# Altium schematic sheet max5134.SchDoc
size A4
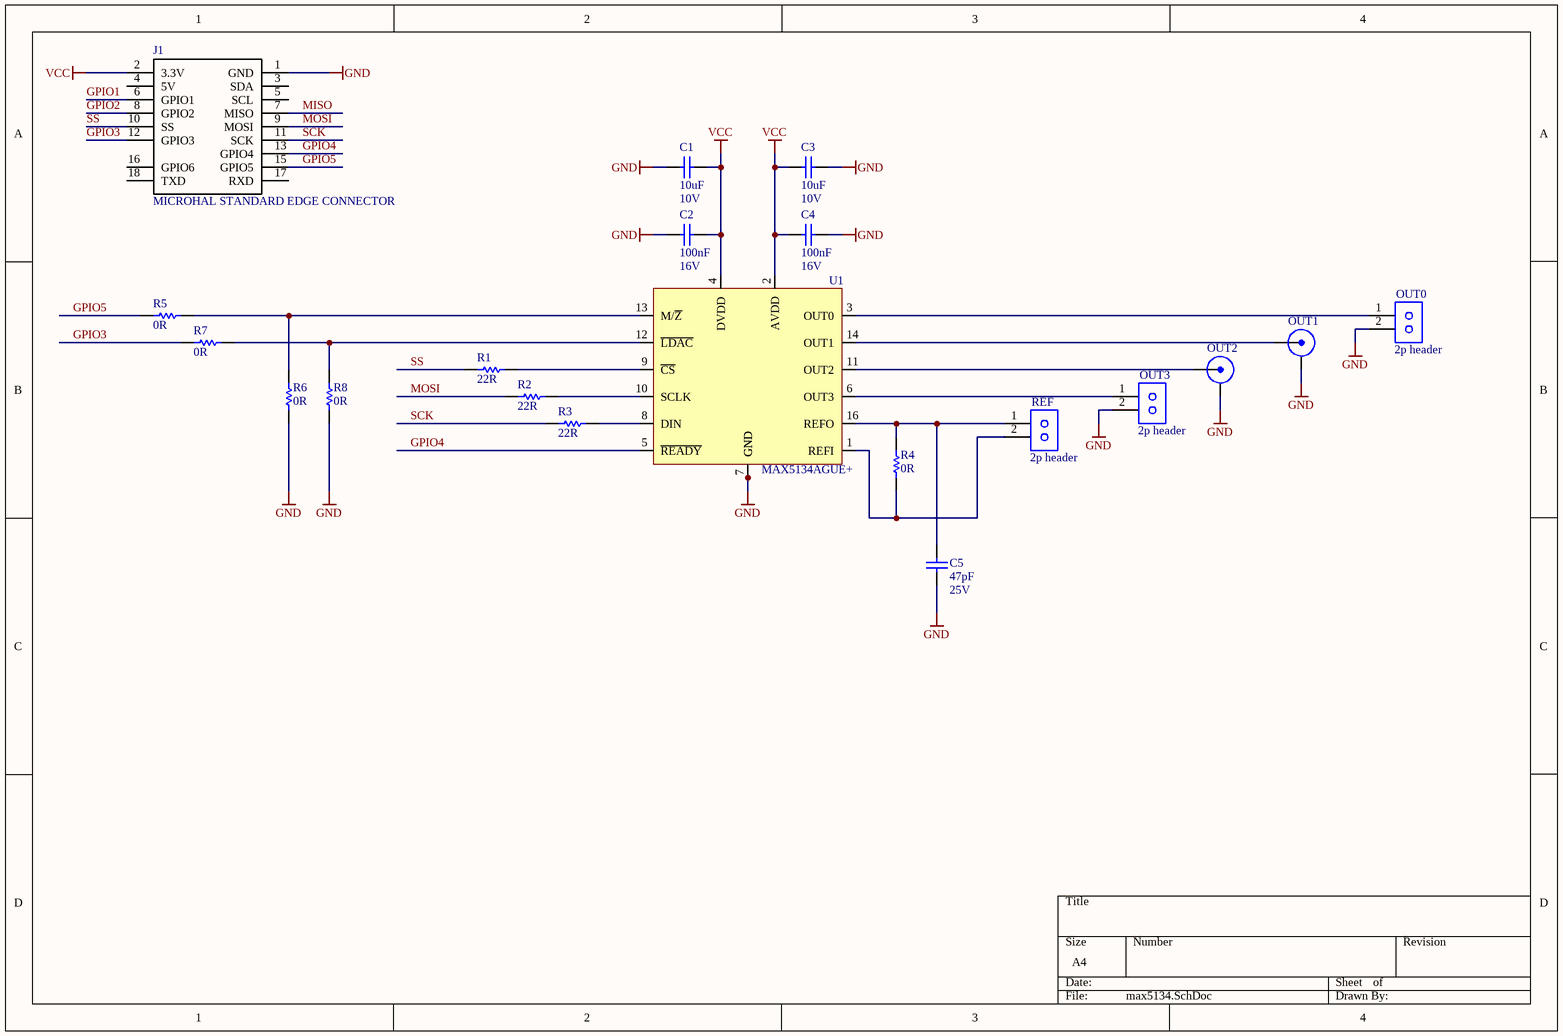
[diagram p0: max5134.SchDoc]

## Parts
C1  value 10uF  Voltage: 10V  [PCB-pgfgxap6j3hfn0qwxn05-1]  (hidden comment: Cap)
C2  value 100nF  Voltage: 16V  [PCB-ul7goghxin8pri3xfob7-1]  (hidden comment: Cap)
C3  value 10uF  Voltage: 10V  [PCB-pgfgxap6j3hfn0qwxn05-1]  (hidden comment: Cap)
C4  value 100nF  Voltage: 16V  [PCB-ul7goghxin8pri3xfob7-1]  (hidden comment: Cap)
C5  Capacitance: 47pF  Voltage Rating (DC): 25V  [CAPC1608X87X35NL15T15]  (hidden comment: Kemet C0603C470J3GACTU)
J1  MICROHAL STANDARD EDGE CONNECTOR  [PCB-n61ghpg3sznbl2uw6fwj-1]
OUT0  2p header  [PCB-b2cwpysm67pz35t2479s-1]
OUT1  Amphenol Connex 132136RP  [PCB-qsvob2veabkktiupk4ti-1]  (value not drawn)
OUT2  Amphenol Connex 132136RP  [PCB-qsvob2veabkktiupk4ti-1]  (value not drawn)
OUT3  2p header  [PCB-b2cwpysm67pz35t2479s-1]
R1  Resistance: 22R  [RESC1609X50X30ML10T20]  (hidden comment: Vishay Dale CRCW060322R0JNEA)
R2  Resistance: 22R  [RESC1609X50X30ML10T20]  (hidden comment: Vishay Dale CRCW060322R0JNEA)
R3  Resistance: 22R  [RESC1609X50X30ML10T20]  (hidden comment: Vishay Dale CRCW060322R0JNEA)
R4  value 0R  [RESC1609X50X30ML10T20]  (hidden comment: Res1)
R5  value 0R  [RESC1609X50X30ML10T20]  (hidden comment: Res1)
R6  value 0R  [RESC1609X50X30ML10T20]  (hidden comment: Res1)
R7  value 0R  [RESC1609X50X30ML10T20]  (hidden comment: Res1)
R8  value 0R  [RESC1609X50X30ML10T20]  (hidden comment: Res1)
REF  2p header  [PCB-b2cwpysm67pz35t2479s-1]
U1  MAX5134AGUE+  [PCB-2k17843fb1qbvpte9n1l-1]

## Nets
GND: C1.2 C2.2 C3.1 C4.1 C5.2 J1.1(GND) OUT0.2 OUT1.2 OUT2.2 OUT3.2 R6.2 R8.2 U1.7(GND) U1.15(GND)
VCC: C1.1 C2.1 C3.2 C4.2 J1.2(3.3V) U1.2(AVDD) U1.4(DVDD)
GPIO1: J1.6(GPIO1)
GPIO2: J1.8(GPIO2)
GPIO3: J1.12(GPIO3) R7.2
GPIO4: J1.13(GPIO4) U1.5(~{READY})
GPIO5: J1.15(GPIO5) R5.2
MISO: J1.7(MISO)
MOSI: J1.9(MOSI) R2.1
SCK: J1.11(SCK) R3.1
SS: J1.10(SS) R1.1
NetC5_1: C5.1 R4.2 REF.1 U1.16(REFO)
NetOUT0_1: OUT0.1 U1.3(OUT0)
NetOUT1_1: OUT1.1 U1.14(OUT1)
NetOUT2_1: OUT2.1 U1.11(OUT2)
NetOUT3_1: OUT3.1 U1.6(OUT3)
NetR1_2: R1.2 U1.9(~{CS})
NetR2_2: R2.2 U1.10(SCLK)
NetR3_2: R3.2 U1.8(DIN)
NetR4_1: R4.1 REF.2 U1.1(REFI)
NetR5_1: R5.1 R6.1 U1.13(M/~{Z})
NetR7_1: R7.1 R8.1 U1.12(~{LDAC})

Not connected (* = marked no-connect by the designer): J1 3(SDA) 4(5V) 5(SCL) 16(GPIO6) 17(RXD) 18(TXD)

## Library data of the parts
C1 C3 = CMP-0c34c7653e6ad3f3-1: Cap Ceramic 10uF 10V X7R 10% Pad SMD 0805 Soft Termination 125C Automotive T/R; RoHS: Compliant; Octopart URL: https://octopart.com/gcj21br71a106ke01l-murata-39524152; Mounting Style: Surface Mount
C2 C4 = CMP-4ca9852e0e1c936e-3: CL10 Series 0.1 uF 16 V ±10% Tolerance X7R SMT Multilayer Ceramic Capacitor
C5 = CMP-148602-2: Multilayer Ceramic Capacitors MLCC - SMD/SMT 25volts 47pF C0G 5%; Dielectric Characteristic: C0G/NP0; Lead-Free Status: Lead Free; Capacitance Tolerance: ±5%; Case/Package: 0603; Dielectric Material: Ceramic; Mounting Style: Surface Mount; Octopart Url: https://octopart.com/c0603c470j3gactu-kemet-8375742; OctopartID: 126bdb1efab3cdac; Packaging: Cut Tape (CT); RoHS: Compliant
J1 = CMP-6a3uyflm72uf0am1b36s-2: microhal standard edge connector with 17 pins
OUT0 OUT3 REF = CMP-748fbcb73d6bab48-6: Board-To-Board Connector, Vertical, WR-PHD Series, Through Hole, Header, 2, 2.54 mm; Gender: Male; Contact Plating: Gold; Octopart URL: http://octopart.com/61300211121-w%C3%BCrth+elektronik-20081794; Contact Material: Copper; REACH SVHC Compliance: No SVHC
OUT1 OUT2 = CMP-acee67bfc04a7329-6: Connector; RF; SMA Right Angle PCB Jack Through Hole 50 Ohm Reverse Polarized; Lead-Free Status: Lead Free; Gender: Female; Contact Plating: Gold; Octopart URL: http://octopart.com/132136rp-amphenol+connex-39537090; OctopartID: acee67bfc04a7329; RoHS: Compliant; Contact Material: Brass; Mounting Style: Through Hole; Manufacturer Part Number: 132136RP
R1-R3 = CMP-1856016-2: RES SMD 22 OHM 5% 1/10W 0603; Lead-Free Status: Lead Free; Power Rating: 0.1 W; Temperature Coefficient: 200.0 ppm/°C; Voltage Rating (DC): 75.0 V; Case/Package: 0603; Mounting Style: Surface Mount; Number of Pins: 2; Octopart Url: https://octopart.com/crcw060322r0jnea-vishay-39811628; OctopartID: 4df186a412bb9236; REACH SVHC Compliance: No SVHC; Resistance Tolerance: ±5%; RoHS: Compliant; Size-Height: 0.00045 m; Size-Length: 0.00155 m; Size-Width: 0.00085 m
R4-R8 = CMP-1855984-13: Resistor; Thick Film; 0 Ohms; 0.1 W; 0 Ohms Jumper; SMT; 0603; TCR 0 ppm/DegC; TR; REACH SVHC Compliance: No SVHC
U1 = CMP-b72d7cb8b58168ea-4: DAC 4-CH Resistor-String 16-bit 16-Pin TSSOP